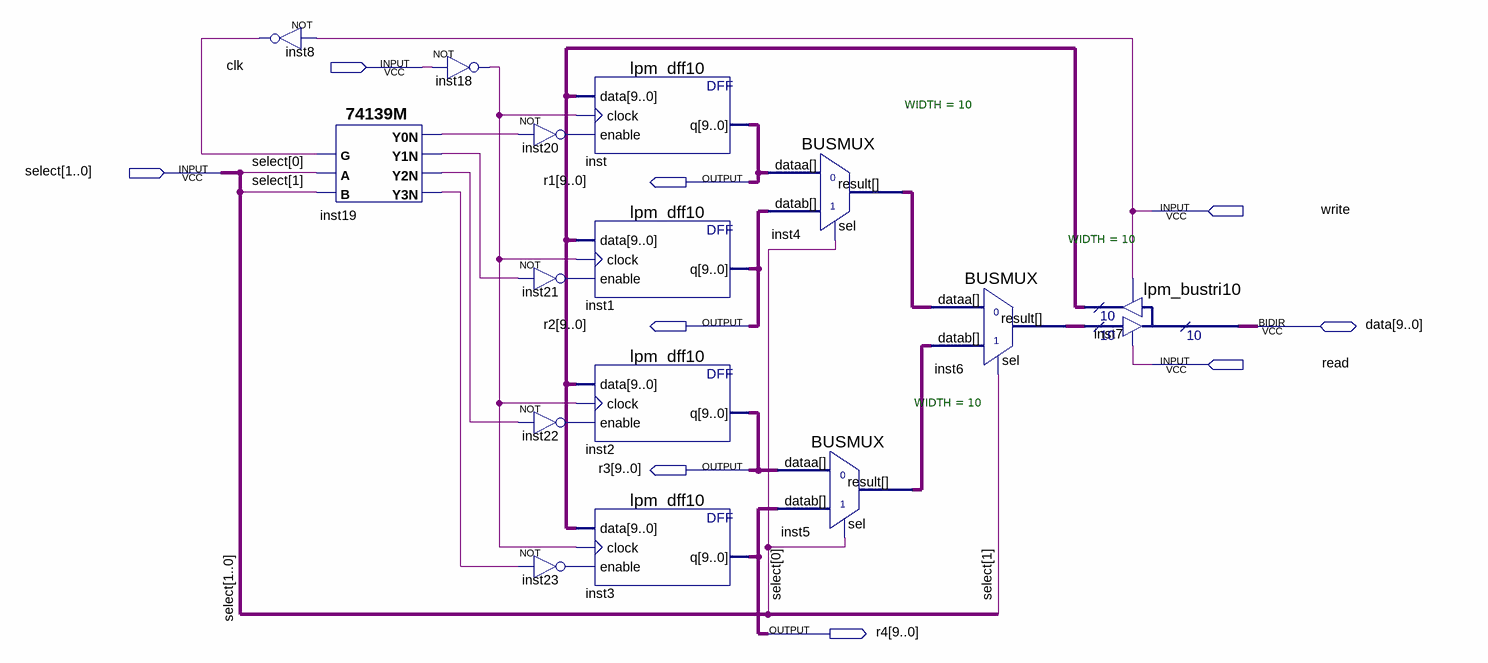
[diagram p0: schematic sheet]
// Quartus schematic gpr.bdf as structural Verilog: 15 symbols, 9 pins
module gpr (
  input  clk,
  input  [1:0] select,
  input  write,
  input  read,
  inout  [9:0] data,
  output [9:0] r1,
  output [9:0] r2,
  output [9:0] r3,
  output [9:0] r4
);

  wire inst8_out, inst18_out, inst19_y0n, inst19_y1n, inst19_y2n, inst19_y3n, inst20_out, inst21_out,
       inst22_out, inst23_out;
  wire [9:0] inst4_result, inst5_result, inst6_result, inst7_result;

  not inst8 (inst8_out, write);
  \74139M  inst19 (
    .B(select[1]), .A(select[0]), .G(inst8_out), .Y3N(inst19_y3n), .Y2N(inst19_y2n), .Y0N(inst19_y0n),
    .Y1N(inst19_y1n));
  not inst18 (inst18_out, clk);
  not inst20 (inst20_out, inst19_y0n);
  not inst21 (inst21_out, inst19_y1n);
  not inst22 (inst22_out, inst19_y2n);
  not inst23 (inst23_out, inst19_y3n);
  lpm_dff10 inst (.data(inst7_result), .clock(inst18_out), .enable(inst20_out), .q(r1));
  lpm_dff10 inst1 (.data(inst7_result), .clock(inst18_out), .enable(inst21_out), .q(r2));
  lpm_dff10 inst2 (.data(inst7_result), .clock(inst18_out), .enable(inst22_out), .q(r3));
  lpm_dff10 inst3 (.data(inst7_result), .clock(inst18_out), .enable(inst23_out), .q(r4));
  BUSMUX #(.WIDTH(10)) inst4 (.datab(r2), .sel(select[0]), .dataa(r1), .result(inst4_result));
  BUSMUX #(.WIDTH(10)) inst5 (.datab(r4), .sel(select[0]), .dataa(r3), .result(inst5_result));
  BUSMUX #(.WIDTH(10)) inst6 (.datab(inst5_result), .sel(select[1]), .dataa(inst4_result), .result(inst6_result));
  lpm_bustri10 inst7 (.enabledt(read), .data(inst6_result), .enabletr(write), .result(inst7_result), .tridata(data));
endmodule
